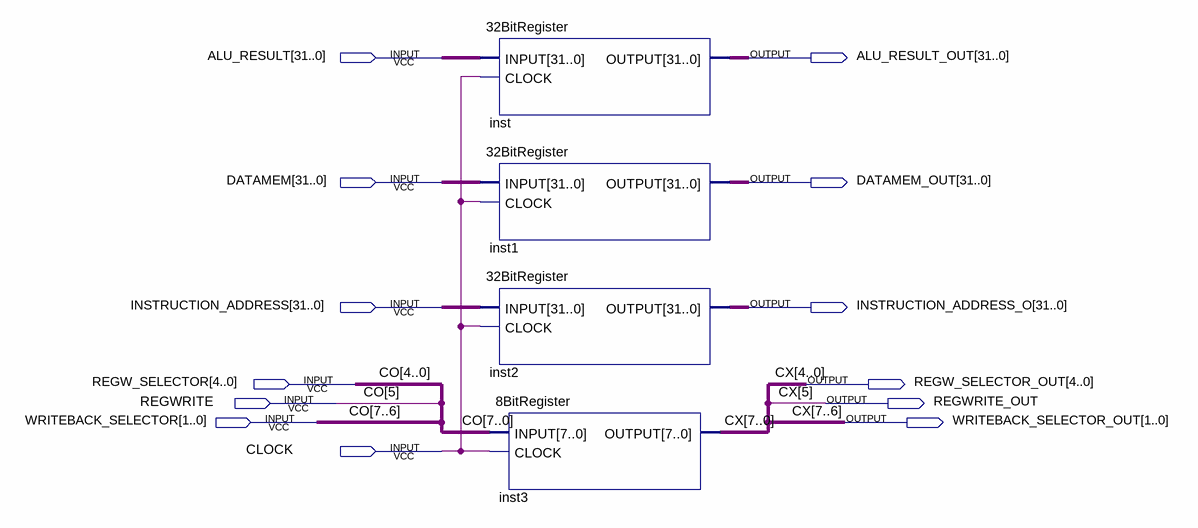
[diagram p0: schematic sheet]
// Quartus schematic MEMACCESS_WRITEBACK.bdf as structural Verilog: 4 symbols, 13 pins
module MEMACCESS_WRITEBACK (
  input  [31:0] ALU_RESULT,
  input  [31:0] DATAMEM,
  input  [31:0] INSTRUCTION_ADDRESS,
  input  [4:0] REGW_SELECTOR,
  input  REGWRITE,
  input  [1:0] WRITEBACK_SELECTOR,
  input  CLOCK,
  output [31:0] ALU_RESULT_OUT,
  output [31:0] DATAMEM_OUT,
  output [31:0] INSTRUCTION_ADDRESS_O,
  output [4:0] REGW_SELECTOR_OUT,
  output REGWRITE_OUT,
  output [1:0] WRITEBACK_SELECTOR_OUT
);

  \32BitRegister  inst (.INPUT(ALU_RESULT), .CLOCK(CLOCK), .OUTPUT(ALU_RESULT_OUT));
  \32BitRegister  inst1 (.INPUT(DATAMEM), .CLOCK(CLOCK), .OUTPUT(DATAMEM_OUT));
  \32BitRegister  inst2 (.INPUT(INSTRUCTION_ADDRESS), .CLOCK(CLOCK), .OUTPUT(INSTRUCTION_ADDRESS_O));
  \8BitRegister  inst3 (
    .INPUT({WRITEBACK_SELECTOR, REGWRITE, REGW_SELECTOR}), .CLOCK(CLOCK),
    .OUTPUT({WRITEBACK_SELECTOR_OUT, REGWRITE_OUT, REGW_SELECTOR_OUT}));

  // Other names for the same wires on the sheet: CO[7:0] = {WRITEBACK_SELECTOR, REGWRITE, REGW_SELECTOR};
  //   CX[7:0] = {WRITEBACK_SELECTOR_OUT, REGWRITE_OUT, REGW_SELECTOR_OUT}
endmodule
